# Altium project 咸味勺子-20210715.PrjPcb
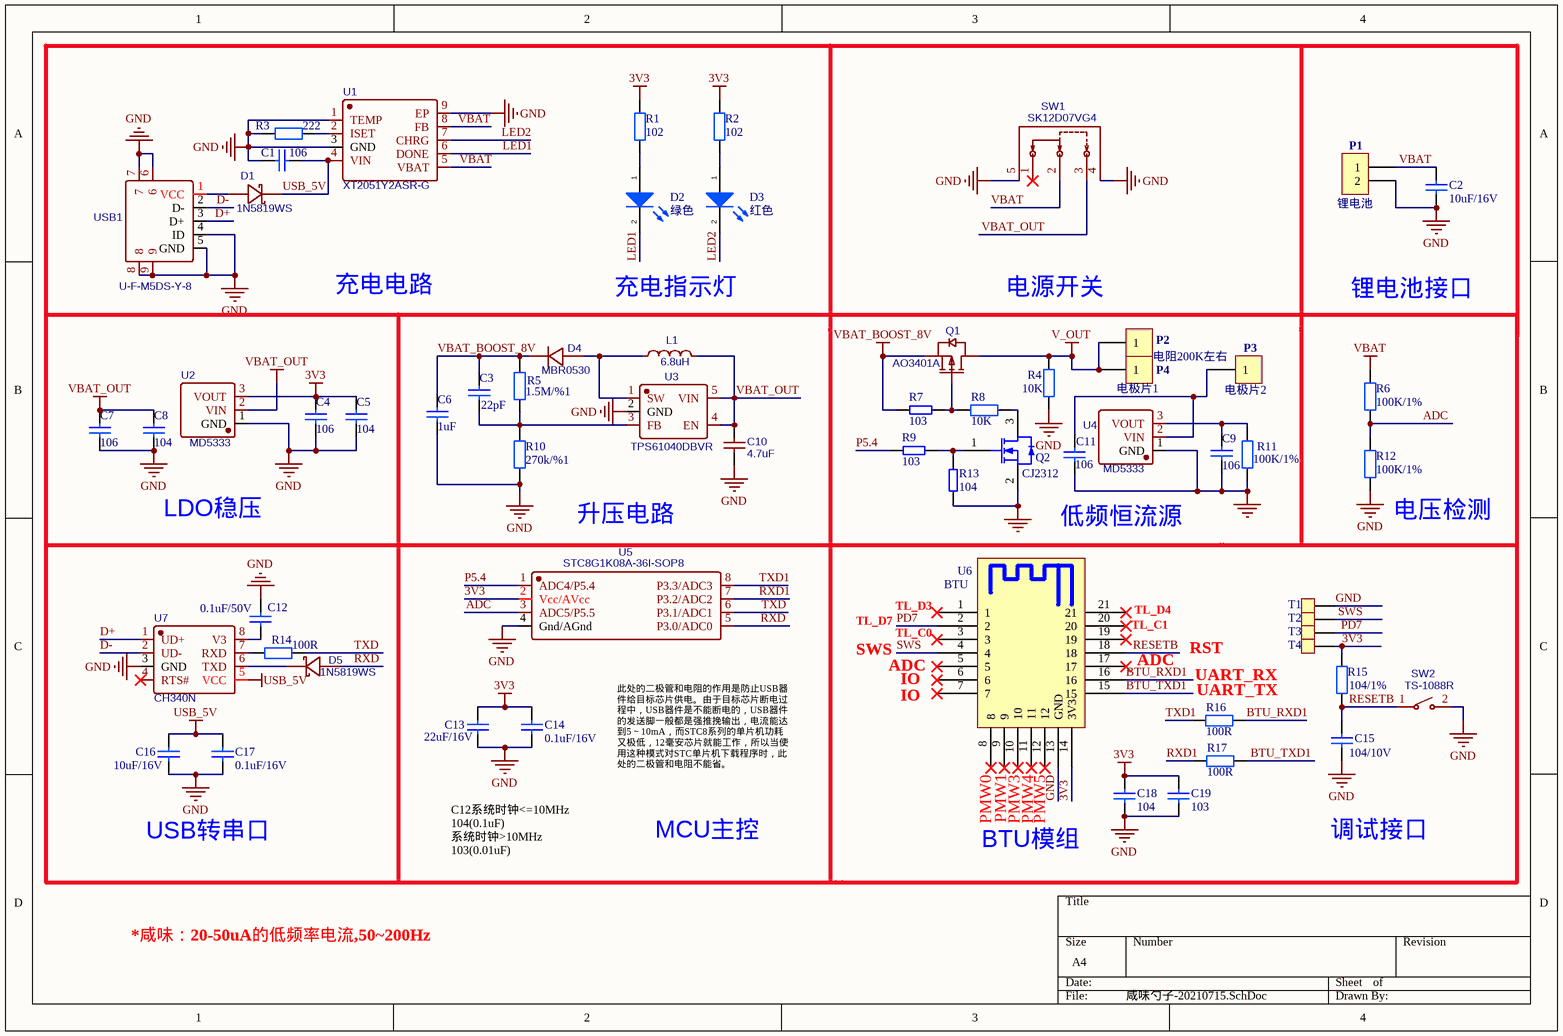
[diagram p0: 咸味勺子-20210715.SchDoc]
1 sheet, 62 parts. Net scope: global (net labels, ports and power ports of the same name join across sheets).
Board file: 咸味勺子-20210715.PcbDoc

## Sheet 咸味勺子-20210715.SchDoc
size A4

### Parts
C1  106  [C0603]
C2  10uF/16V  [C0603]
C3  22pF  [C0402_GRM15]
C4  106  [C0603]
C5  104  [C0402_GRM15]
C6  1uF  [C0603]
C7  106  [C0603]
C8  104  [C0402_GRM15]
C9  106  [C0603]
C10  4.7uF  [JMK212BJ475KG-T]
C11  106  [C0603]
C12  0.1uF/50V  [C0402_GRM15]
C13  22uF/16V  [C0603]
C14  0.1uF/16V  [C0402_GRM15]
C15  104/10V  [C0402_GRM15]
C16  10uF/16V  [C0603]
C17  0.1uF/16V  [C0402_GRM15]
C18  104  [C0402_GRM15]
C19  103  [C0402_GRM15]
D1  1N5819WS  [1N5819WS]
D2  绿色  [OSR50603C1E]
D3  红色  [OSR50603C1E]
D4  MBR0530  [MBR0530]
D5  1N5819WS  [1N5819WS]
L1  6.8uH  [CDRH3D23NP-6R8PC]
P1  锂电池  [1.5mm 2p接插件]
P2  CON1  [焊点1]  (value not drawn)
P3  CON1  [焊点1]  (value not drawn)
P4  CON1  [焊点1]  (value not drawn)
Q1  AO3401A  [AO3401A]
Q2  CJ2312  [CJ2312]
R1  102  [R0402]
R2  102  [R0402]
R3  222  [R0402]
R4  10K  [R0402]
R5  1.5M/%1  [R0402]
R6  100K/1%  [R0402]
R7  103  [R0402]
R8  10K  [R0402]
R9  103  [R0402]
R10  270k/%1  [R0402]
R11  100K/1%  [R0402]
R12  100K/1%  [R0402]
R13  104  [R0402]
R14  100R  [R0402]
R15  104/1%  [R0402]
R16  100R  [R0402]
R17  100R  [R0402]
SW1  SK12D07VG4  [SK12D07VG4]
SW2  TS-1088R  [TS-1088R-02026]
T1  TP  [TP1]  (value not drawn)
T2  TP  [TP1]  (value not drawn)
T3  TP  [TP1]  (value not drawn)
T4  TP  [TP1]  (value not drawn)
U1  XT2051Y2ASR-G  [XT2051Y2ASR-G]
U2  MD5333  [MD5333]
U3  TPS61040DBVR  [TPS61040DBVR]
U4  MD5333  [MD5333]
U5  STC8G1K08A-36I-SOP8  [STC8G1K08A-36I-SOP8]
U6  BTU  [CBU1]
U7  CH340N  [CH340N]
USB1  U-F-M5DS-Y-8  [U-F-M5DS-Y-8]

### Nets
3V3: C4.1 C5.1 C13.2 C14.2 C18.1 C19.1 R1.2 R2.2 R15.2 T4.1 U2.3(VOUT) U5.2(Vcc/AVcc) U6.14(3V3)
GND: C1.2 C2.2 C4.2 C5.2 C6.2 C7.2 C8.2 C9.2 C10.1 C11.2 C12.2 C13.1 C14.1 C15.2 C16.1 C17.1 C18.2 C19.2 P1.2 Q2.2(S) R3.2 R4.2 R10.1 R11.1 R12.1 R13.1 SW1.4 SW1.5 SW2.2 T1.1 U1.1(TEMP) U1.3(GND) U1.9(EP) U2.1(GND) U3.2(GND) U4.1(GND) U5.4(Gnd/AGnd) U6.13(GND) U7.3(GND) USB1.4(ID) USB1.5(GND) USB1.6 USB1.7 USB1.8 USB1.9
USB_5V: C1.1 C16.2 C17.2 D1.1(C) U1.4(VIN) U7.5(VCC)
V_OUT: P2.1 P4.1 Q1.3(D) R4.1
VBAT: C2.1 P1.1 R6.2 SW1.2 U1.5(VBAT) U1.8(FB)
VBAT_BOOST_8V: C3.1 C6.1 D4.1(K) Q1.2(S) R5.2 R7.1
VBAT_OUT: C7.1 C8.1 C10.2 L1.2 SW1.3 U2.2(VIN) U3.4(EN) U3.5(VIN)
ADC: R6.1 R12.2 U5.3(ADC5/P5.5)
BTU_RXD1: R16.1 U6.16
BTU_TXD1: R17.1 U6.15
D+: U7.1(UD+) USB1.3(D+)
D-: U7.2(UD-) USB1.2(D-)
LED1: D2.2 U1.6(DONE)
LED2: D3.2 U1.7(CHRG)
P5.4: R9.1 U5.1(ADC4/P5.4)
PD7: T3.1 U6.2
RESETB: C15.1 R15.1 SW2.1 U6.18
RXD: D5.2(A) U5.5(P3.0/ADC0)
RXD1: R17.2 U5.7(P3.2/ADC2)
SWS: T2.1 U6.4
TXD: R14.2 U5.6(P3.1/ADC1)
TXD1: R16.2 U5.8(P3.3/ADC3)
NetC3_2: C3.2 R5.1 R10.2 U3.3(FB)
NetC9_1: C9.1 R11.2 U4.3(VOUT)
NetC11_1: C11.1 P3.1 U4.2(VIN)
NetC12_1: C12.1 U7.8(V3)
NetD1_2: D1.2(A) USB1.1(VCC)
NetD2_1: D2.1 R1.1
NetD3_1: D3.1 R2.1
NetD4_2: D4.2(A) L1.1 U3.1(SW)
NetD5_1: D5.1(C) U7.6(TXD)
NetQ1_1: Q1.1(G) R7.2 R8.1
NetQ2_1: Q2.1(G) R9.2 R13.2
NetQ2_3: Q2.3(D) R8.2
NetR3_1: R3.1 U1.2(ISET)
NetR14_1: R14.1 U7.7(RXD)

Not connected (* = marked no-connect by the designer): SW1 1*; U6 1* 3* 5* 6* 7* 8* 9* 10* 11* 12* 17* 19* 20* 21*; U7 4(RTS#)*

### Notes on the sheet
- 充电电路
- 充电指示灯
- 电源开关
- 锂电池接口
- 电阻200K左右
- (near P4) 电极片1
- (near P3) 电极片2
- LDO稳压
- (near R12) 电压检测
- 升压电路
- 低频恒流源
- SWS
- TL_D7
- (near U6) TL_D3
- (near U6) TL_C0
- (near U6) TL_C1
- (near U6) TL_D4
- RST
- ADC
- IO
- (near R16) UART_RX
- (near R16) UART_TX
- USB转串口
- C12系统时钟<=10MHz
  104(0.1uF)
  系统时钟>10MHz
  103(0.01uF)
- 此处的二极管和电阻的作用是防止USB器件给目标芯片供电。由于目标芯片断电过程中，USB器件是不能断电的，USB器件的发送脚一般都是强推挽输出，电流能达到5～10mA，而STC8系列的单片机功耗又极低，12毫安芯片就能工作，所以当使用这种模式对STC单片机下载程序时，此处的二极管和电阻不能省。
- MCU主控
- BTU模组
- PMW0
- PMW1
- PMW3
- PMW4
- PMW5
- 调试接口
- *咸味：20-50uA的低频率电流,50~200Hz

### Library data of the parts
C1 C13 C16 = 1.02.03.00181: 无极性电容; Value: 1uF/16V; 物料通用性等级: 高; 工作温度: null; 物料描述: 瓷介电容;贴片;X7R;1UF;±10%;16V;0603; 制造商: 三星(SAMSUNG); 制造商型号: CL10B105KO8NNNC; Orcad Library: #N/A; 管脚数量: 2; 安装方式: 贴片; 物料类目: 瓷介电容; 物料状态: 已发布; 修改人: system; 物料生产状态: 量产; Part Number: 1.02.03.00181; ComponentLink2Description: 三星MLCC.pdf; ComponentLink2URL: file:///\\172.16.246.8\lib-ad\DBlib\Datasheet\电容类资料\三星MLCC.pdf; Orcad Library Path: #N/A; Orcad Footprint: #N/A; Orcad Footprint Path: #N/A; 器件高度: null; 更新时间: 2021-03-25 10:51:02; ALT_SYMBOLS: #N/A
C2-C9 C11 C15 C18 C19 = 1.02.05.00869: 无极性电容; Part Number: 1.02.05.00869
C10 = 4.7uF: BOM_Manufacturer: TAIYO YUDEN; nameAlias: Capacitance; BOM_Supplier: LCSC; BOM_Manufacturer Part: JMK212BJ475KG-T; BOM_Supplier Part: C92788; spicePre: C; spiceSymbolName: JMK212BJ475KG-T
C12 = 1.02.05.00834: 无极性电容; 物料通用性等级: 高; 工作温度: null; 物料描述: 瓷介电容;贴片;X7R;0.1UF;±10%;50V;0603; 制造商: 华科; 制造商型号: 0603B104K500CT; Orcad Library: C; Orcad Library Path: Z:\tuya_lib\sch-lib\DISCRETE.OLB; Orcad Footprint: c0603,c0603a; Orcad Footprint Path: Z:\tuya_lib\footprint; 管脚数量: 2; 安装方式: 贴片; 物料类目: 瓷介电容; 物料状态: 已发布; 修改人: system; 物料生产状态: 量产; Part Number: 1.02.05.00834; Value: 0.1uF/50V; ComponentLink2Description: null; ComponentLink2URL: null; 器件高度: null; 更新时间: 2021-03-25 10:51:02; ALT_SYMBOLS: c0603,c0603a
C14 C17 = 1.02.05.00834: 无极性电容; Value: 0.1uF/50V; 物料通用性等级: 高; 工作温度: null; 物料描述: 瓷介电容;贴片;X7R;0.1UF;±10%;50V;0603; 制造商: 华科; 制造商型号: 0603B104K500CT; Orcad Library: C; Orcad Library Path: Z:\tuya_lib\sch-lib\DISCRETE.OLB; Orcad Footprint: c0603,c0603a; Orcad Footprint Path: Z:\tuya_lib\footprint; 管脚数量: 2; 安装方式: 贴片; 物料类目: 瓷介电容; 物料状态: 已发布; 修改人: system; 物料生产状态: 量产; Part Number: 1.02.05.00834; ComponentLink2Description: null; ComponentLink2URL: null; 器件高度: null; 更新时间: 2021-03-25 10:51:02; ALT_SYMBOLS: c0603,c0603a
D1 D5 = 1N5819WS_C1884554: BOM_Manufacturer: YFW佑风微; Contributor: LCSC; BOM_Supplier: LCSC; BOM_Supplier Part: C1884554; BOM_Manufacturer Part: 1N5819WS; BOM_JLCPCB Part Class: Extended Part; spicePre: D; spiceSymbolName: 1N5819WS_C1884554
D2 D3 = 1.06.02.00452: LED; Part Number: 1.06.02.00452
D4 = MBR0530_C475718: BOM_Manufacturer: Shikues; Contributor: LCSC; BOM_Supplier: LCSC; BOM_Supplier Part: C475718; BOM_Manufacturer Part: MBR0530; BOM_JLCPCB Part Class: Extended Part; spicePre: D; spiceSymbolName: MBR0530_C475718
L1 = 6.8uH: BOM_Manufacturer: Sumida; nameAlias: Inductance; Contributor: LCSC; BOM_Supplier: LCSC; BOM_Supplier Part: C323532; BOM_Manufacturer Part: CDRH3D23NP-6R8PC; spicePre: L; spiceSymbolName: CDRH3D23NP-6R8PC
P1 = CON2: Connector
Q1 = AO3401A_C700954: BOM_Manufacturer: HUASHUO(华朔); Contributor: LCSC; BOM_Supplier: LCSC; BOM_Supplier Part: C700954; BOM_Manufacturer Part: AO3401A; BOM_JLCPCB Part Class: Extended Part; spicePre: Q; spiceSymbolName: AO3401A_C700954
Q2 = 1.06.11.00008: N-Channel MOSFET; 物料通用性等级: 高; 工作温度: null; 物料描述: 场效应管;N沟道;CJ2312;20V;5A;31.8MR/4.5V;SOT-23;贴片; 制造商: 江苏长电; Orcad Library: FETN_GSD; Orcad Library Path: ‪Z:\tuya_lib\sch-lib\DISCRETE.OLB; Orcad Footprint: sot23-3; Orcad Footprint Path: Z:\tuya_lib\footprint; 管脚数量: 3; 器件高度: 1.15mm; 安装方式: 贴片; 物料类目: 场效应管; 物料状态: 已发布; 修改人: system; 物料生产状态: 量产; Part Number: 1.06.11.00008; Value: CJ2312; ComponentLink2Description: CJ2312.pdf; ComponentLink2URL: file:///\\172.16.246.8\lib-ad\DBlib\Datasheet\三极管资料\CJ2312.pdf; 制造商型号: CJ2312; 更新时间: 2021-03-25 10:51:02
R1-R3 R15-R17 = 1.01.01.00808: 电阻; Part Number: 1.01.01.00808
R4-R6 R8 R10-R12 = 100K/1%: 电阻; Value: 100K/1%
R7 R9 R13 = RES-1: RES
R14 = 1.01.01.00808: 电阻; Value: 200R; 物料通用性等级: 中; 工作温度: null; 物料描述: 普通电阻;200R;±5%;0603;1/10W;贴片;; 制造商: 厚声(UniOhm); 制造商型号: 0603WAJ0201***; Orcad Library: R; Orcad Library Path: Z:\tuya_lib\sch-lib\DISCRETE.OLB; Orcad Footprint: r0603; Orcad Footprint Path: Z:\tuya_lib\footprint; 管脚数量: 2; 安装方式: 贴片; 物料类目: 普通电阻; 物料状态: 已发布; 修改人: system; 物料生产状态: 量产; Part Number: 1.01.01.00808; ComponentLink2Description: 厚生电阻规格书.pdf; ComponentLink2URL: file:///\\172.16.246.8\lib-ad\DBlib\Datasheet\电阻类\厚生电阻规格书.pdf; 器件高度: null; 更新时间: 2021-03-25 10:51:02; ALT_SYMBOLS: r0603
SW1 = SK12D07VG4: BOM_Manufacturer: SHOU HAN; Contributor: LCSC; BOM_Supplier: LCSC; BOM_Supplier Part: C393937; BOM_Manufacturer Part: SK12D07VG4; BOM_JLCPCB Part Class: Extended Part; spicePre: S; spiceSymbolName: SK12D07VG4
SW2 = TS-1088R-02026: BOM_Manufacturer: XUNPU; Contributor: LCSC; BOM_Paste Type: expand; BOM_Supplier: LCSC; BOM_Supplier Part: C455280; BOM_Manufacturer Part: TS-1088R-02026; spicePre: S; spiceSymbolName: TS-1088R-02026
U1 = XT2051Y2ASR-G: BOM_Manufacturer: NATLINEAR; Contributor: LCSC; BOM_Supplier: LCSC; BOM_Supplier Part: C236398; BOM_Manufacturer Part: XT2051Y2ASR-G; spicePre: U; spiceSymbolName: XT2051Y2ASR-G
U2 U4 = MD5333: BOM_Manufacturer: 明达微; Contributor: LCSC; BOM_Supplier: LCSC; BOM_Supplier Part: C2827936; BOM_Manufacturer Part: MD5333; BOM_JLCPCB Part Class: Extended Part; spicePre: U; spiceSymbolName: MD5333
U3 = TPS61040DBVR: BOM_Manufacturer: TI; BOM_Supplier: LCSC; BOM_Manufacturer Part: TPS61040DBVR; BOM_Supplier Part: C7722; BOM_JLCPCB Part Class: Basic Part; spicePre: U; spiceSymbolName: TPS61040DBVR
U5 = STC8G1K08A-36I-SOP8: BOM_Manufacturer: STC Micro; Contributor: LCSC; BOM_Supplier: LCSC; BOM_Supplier Part: C915663; BOM_Manufacturer Part: STC8G1K08A-36I-SOP8; BOM_JLCPCB Part Class: Extended Part; spicePre: U; spiceSymbolName: STC8G1K08A-36I-SOP8
U6 = CBU: Part Number: 0110; 制造商: 涂鸦; Process: 贴片; Value: CBU; Component Type: Standard; 描述: CBU; 制造商型号: CBU; Pin Count: 21
U7 = CH340N: BOM_Manufacturer: WCH(Jiangsu Qin Heng); Contributor: LCSC; BOM_Paste Type: expand; BOM_Supplier: LCSC; BOM_Supplier Part: C506813; BOM_Manufacturer Part: CH340N; spicePre: U; spiceSymbolName: CH340N
USB1 = U-F-M5DS-Y-8: BOM_Manufacturer: Korean Hroparts Elec; Contributor: LCSC; BOM_Supplier: LCSC; BOM_Supplier Part: C961761; BOM_Manufacturer Part: U-F-M5DS-Y-8; spicePre: U; spiceSymbolName: U-F-M5DS-Y-8